# EAGLE design pi-zigbee-poe-rtc (EAGLE 9.5.0)
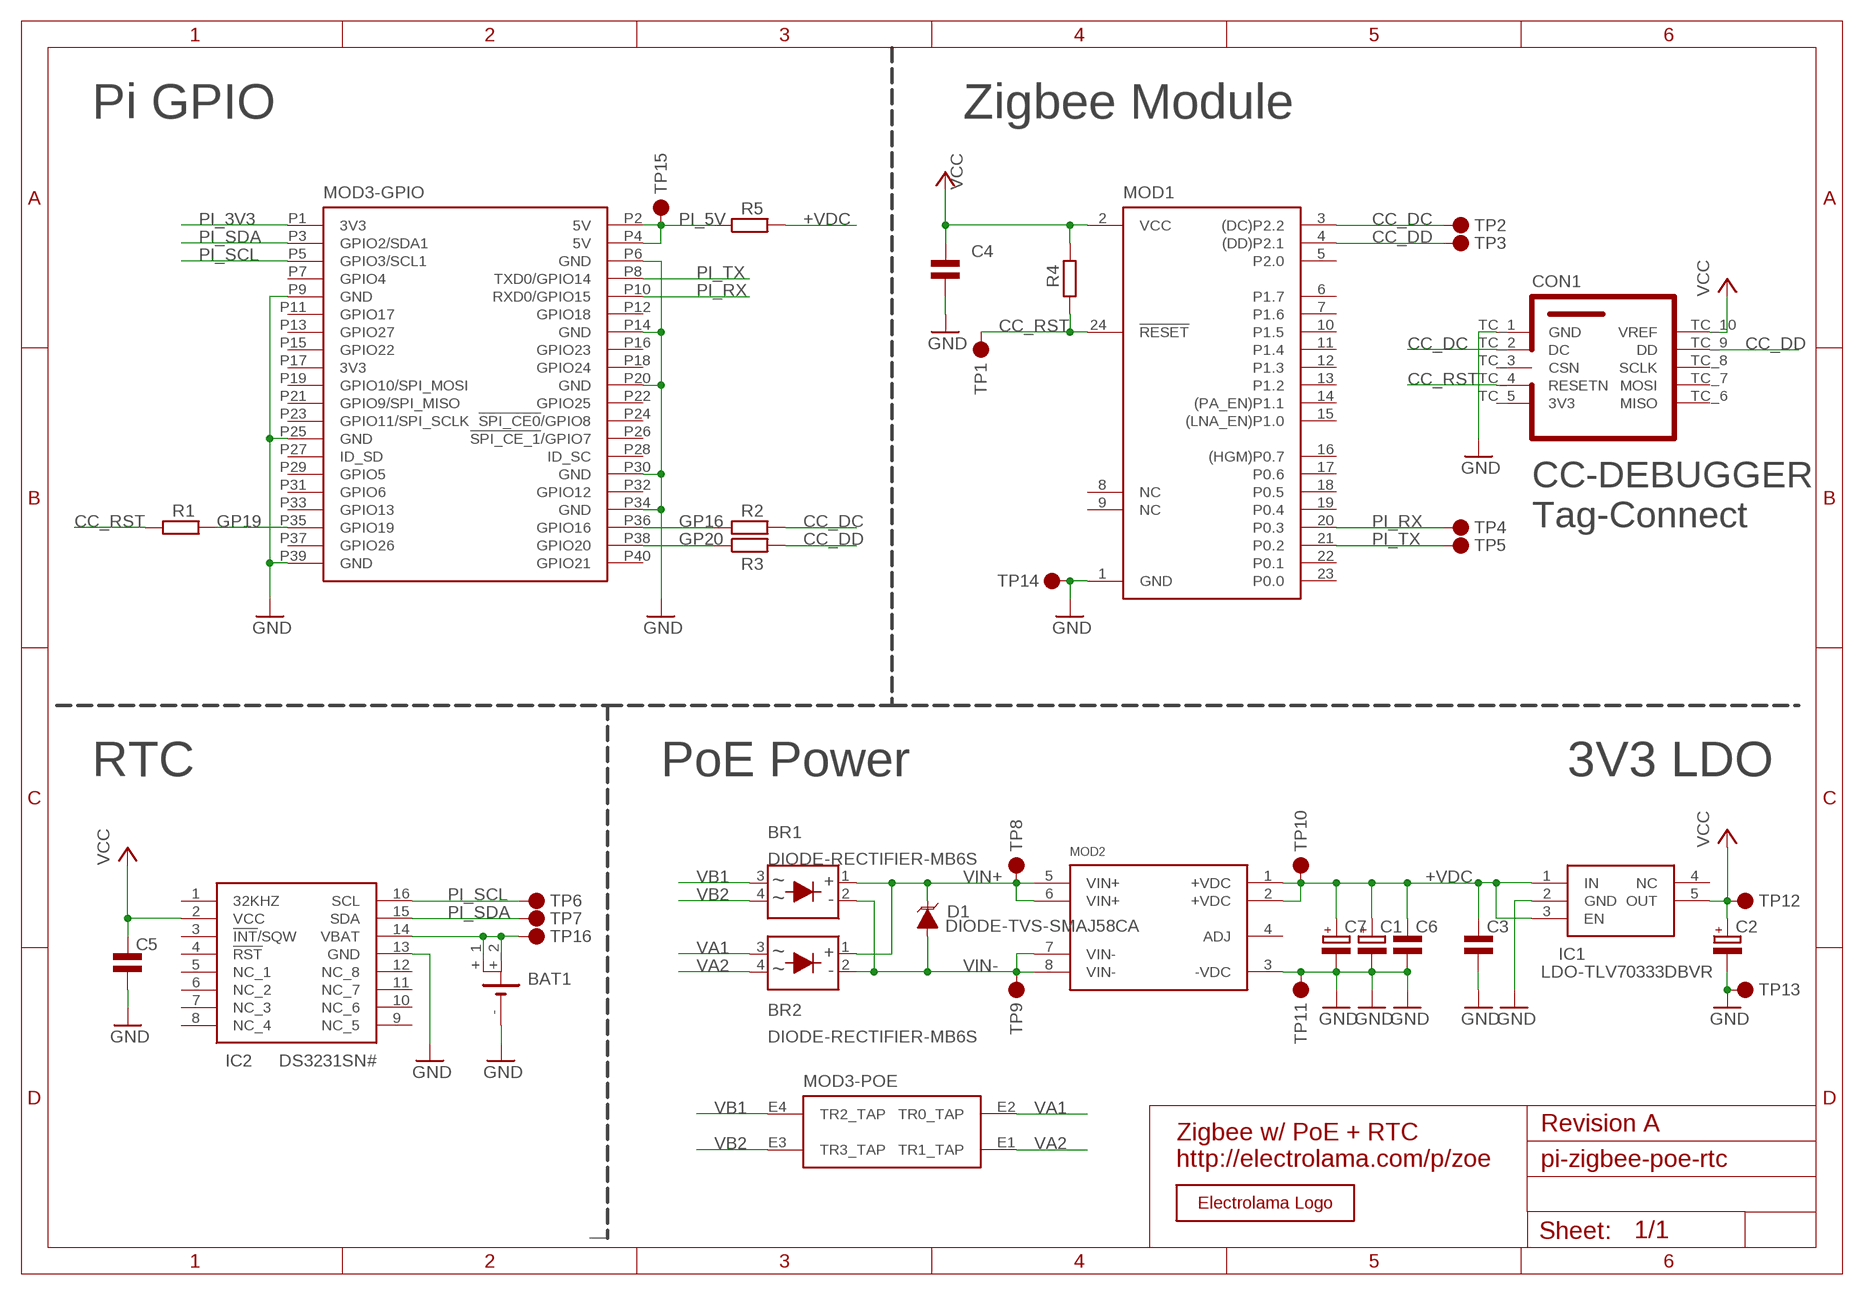
[diagram p0: schematic, sheet 1]

## Parts
BAT1  BATTERY  [KEYSTONE_3001]
BR1  DIODE-RECTIFIER-MB6S  [SOP254P665X270-4N]
BR2  DIODE-RECTIFIER-MB6S  [SOP254P665X270-4N]
C1  CAP-POL-TANT-A  [_CAP_TANT_A/3216-18R]
C2  CAP-POL-TANT-A  [_CAP_TANT_A/3216-18R]
C3  CAP-0603  [_PKG_C_0603]
C4  CAP-0603  [_PKG_C_0603]
C5  CAP-0603  [_PKG_C_0603]
C6  CAP-0603  [_PKG_C_0603]
C7  CAP-POL-ELCO-D8-L10.5  [_CAP_ELCO_D8_L10.5]
CON1  TC2050-IDC-NL_CC-DEBUGGER  [TC2050-IDC-NL]
D1  DIODE-TVS-SMAJ58CA  [DIOM5126X250N]
IC1  LDO-TLV70333DBVR  [SOT95P280X145-5N]
IC2  DS3231SN#  [SOIC127P1032X265-16N]
MOD1  EBYTE-E18-MS1PA1  [EBYTE-E18-MS1PA1]
MOD2  SILVERTEL_AG9800M  [SILVERTEL_AG9800M]
MOD3  RPI-HAT-FULL  [RPI-HAT-FULL]
R1  RES-0603  [_PKG_C_0603]
R2  RES-0603  [_PKG_C_0603]
R3  RES-0603  [_PKG_C_0603]
R4  RES-0603  [_PKG_C_0603]
R5  RES-0603  [_PKG_C_0603]
TP1  TP  [TP]
TP2  TP  [TP]
TP3  TP  [TP]
TP4  TP  [TP]
TP5  TP  [TP]
TP6  TP  [TP]
TP7  TP  [TP]
TP8  TP  [TP]
TP9  TP  [TP]
TP10  TP  [TP]
TP11  TP  [TP]
TP12  TP  [TP]
TP13  TP  [TP]
TP14  TP  [TP]
TP15  TP  [TP]
TP16  TP  [TP]
U$1  LOGO-ELECTROLAMA  [ELECTROLAMA]

## Nets
+VDC: C1.+ C3.1 C6.1 C7.+ IC1.1(IN) IC1.3(EN) MOD2.1(+VDC) MOD2.2(+VDC) R5.2 TP10.TP
CC_DC: CON1.TC_2(DC) MOD1.3((DC)P2.2) R2.2 TP2.TP
CC_DD: CON1.TC_9(DD) MOD1.4((DD)P2.1) R3.2 TP3.TP
CC_RST: CON1.TC_4(RESETN) MOD1.24(!RESET) R1.1 R4.1 TP1.TP
GND: BAT1.- C1.- C2.- C3.2 C4.2 C5.2 C6.2 C7.- CON1.TC_1(GND) IC1.2(GND) IC2.13(GND) MOD1.1(GND) MOD2.3(-VDC) MOD3.P6(-GPIO:GND) MOD3.P9(-GPIO:GND) MOD3.P14(-GPIO:GND) MOD3.P20(-GPIO:GND) MOD3.P25(-GPIO:GND) MOD3.P30(-GPIO:GND) MOD3.P34(-GPIO:GND) MOD3.P39(-GPIO:GND) TP11.TP TP13.TP TP14.TP
GP16: MOD3.P36(-GPIO:GPIO16) R2.1
GP19: MOD3.P35(-GPIO:GPIO19) R1.2
GP20: MOD3.P38(-GPIO:GPIO20) R3.1
N$1: BAT1.+_1(+1) BAT1.+_2(+2) IC2.14(VBAT) TP16.TP
PI_3V3: MOD3.P1(-GPIO:3V3)
PI_5V: MOD3.P2(-GPIO:5V) MOD3.P4(-GPIO:5V) R5.1 TP15.TP
PI_RX: MOD1.20(P0.3) MOD3.P10(-GPIO:RXD0/GPIO15) TP4.TP
PI_SCL: IC2.16(SCL) MOD3.P5(-GPIO:GPIO3/SCL1) TP6.TP
PI_SDA: IC2.15(SDA) MOD3.P3(-GPIO:GPIO2/SDA1) TP7.TP
PI_TX: MOD1.21(P0.2) MOD3.P8(-GPIO:TXD0/GPIO14) TP5.TP
VA1: BR2.3(~) MOD3.E2(-POE:TR0_TAP)
VA2: BR2.4(~) MOD3.E1(-POE:TR1_TAP)
VB1: BR1.3(~) MOD3.E4(-POE:TR2_TAP)
VB2: BR1.4(~) MOD3.E3(-POE:TR3_TAP)
VCC: C2.+ C4.1 C5.1 CON1.TC_10(VREF) IC1.5(OUT) IC2.2(VCC) MOD1.2(VCC) R4.2 TP12.TP
VIN+: BR1.1(+) BR2.1(+) D1.1(C) MOD2.5(VIN+) MOD2.6(VIN+) TP8.TP
VIN-: BR1.2(-) BR2.2(-) D1.2(A) MOD2.7(VIN-) MOD2.8(VIN-) TP9.TP
Unconnected: CON1.TC_3(CSN) CON1.TC_5(3V3) CON1.TC_6(MISO) CON1.TC_7(MOSI) CON1.TC_8(SCLK) IC1.4(NC) IC2.1(32KHZ) IC2.3(!INT!/SQW) IC2.4(!RST) IC2.5(NC_1) IC2.6(NC_2) IC2.7(NC_3) IC2.8(NC_4) IC2.9(NC_5) IC2.10(NC_6) IC2.11(NC_7) IC2.12(NC_8) MOD1.5(P2.0) MOD1.6(P1.7) MOD1.7(P1.6) MOD1.8(NC) MOD1.9(NC) MOD1.10(P1.5) MOD1.11(P1.4) MOD1.12(P1.3) MOD1.13(P1.2) MOD1.14((PA_EN)P1.1) MOD1.15((LNA_EN)P1.0) MOD1.16((HGM)P0.7) MOD1.17(P0.6) MOD1.18(P0.5) MOD1.19(P0.4) MOD1.22(P0.1) MOD1.23(P0.0) MOD2.4(ADJ) MOD3.P7(-GPIO:GPIO4) MOD3.P11(-GPIO:GPIO17) MOD3.P12(-GPIO:GPIO18) MOD3.P13(-GPIO:GPIO27) MOD3.P15(-GPIO:GPIO22) MOD3.P16(-GPIO:GPIO23) MOD3.P17(-GPIO:3V3) MOD3.P18(-GPIO:GPIO24) MOD3.P19(-GPIO:GPIO10/SPI_MOSI) MOD3.P21(-GPIO:GPIO9/SPI_MISO) MOD3.P22(-GPIO:GPIO25) MOD3.P23(-GPIO:GPIO11/SPI_SCLK) MOD3.P24(-GPIO:!SPI_CE0!/GPIO8) MOD3.P26(-GPIO:!SPI_CE_1!/GPIO7) MOD3.P27(-GPIO:ID_SD) MOD3.P28(-GPIO:ID_SC) MOD3.P29(-GPIO:GPIO5) MOD3.P31(-GPIO:GPIO6) MOD3.P32(-GPIO:GPIO12) MOD3.P33(-GPIO:GPIO13) MOD3.P37(-GPIO:GPIO26) MOD3.P40(-GPIO:GPIO21)

## Notes on the sheet
- Pi GPIO | Zigbee Module
- CC-DEBUGGER
  Tag-Connect
- RTC | PoE Power | 3V3 LDO
- Revision A
- Zigbee w/ PoE + RTC
  http://electrolama.com/p/zoe

## Library data of the parts
BAT1 = ok-connectors-dev:BATTERY
BR1 BR2 = ok-discretes-dev:DIODE-RECTIFIER: MICRO COMMERCIAL COMPONENTS - MB6S-TP - BRIDGE RECTIFIER, 500mA, 600V Source: Datasheet <https://componentsearchengine.com/Datasheets/2/MB6S-TP.pdf>; DESCRIPTION: MICRO COMMERCIAL COMPONENTS - MB6S-TP - BRIDGE RECTIFIER, 500mA, 600V; HEIGHT: 2.7mm; MANUFACTURER_NAME: Micro Commercial Components (MCC); MANUFACTURER_PART_NUMBER: MB6S-TP; MOUSER_PART_NUMBER: 833-MB6S-TP; MOUSER_PRICE-STOCK: https://www.mouser.com/Search/Refine.aspx?Keyword=833-MB6S-TP
C1 C2 C7 = ok-discretes-dev:CAP-POL
C3-C6 = ok-discretes-dev:CAP
CON1 = ok-connectors-dev:TC2050-IDC-NL_CC-DEBUGGER
D1 = ok-discretes-dev:DIODE-TVS-SMAJ58CA: DIODE, TVS, 58V, 300W, 2SMA Taiwan Semi SMAJ58CA Bi-Directional TVS Diode, 2-Pin SMA Source: Datasheet <http://uk.rs-online.com/webdocs/0dbc/0900766b80dbc8a0.pdf>; DESCRIPTION: DIODE, TVS, 58V, 300W, 2SMA Taiwan Semi SMAJ58CA Bi-Directional TVS Diode, 2-Pin SMA; HEIGHT: 2.5mm; MANUFACTURER_NAME: Taiwan Semiconductor; MANUFACTURER_PART_NUMBER: SMAJ58CA; MOUSER_PART_NUMBER: N/A; MOUSER_PRICE-STOCK: https://www.mouser.com/Search/Refine.aspx?Keyword=N%2FA
IC1 = ok-chips-dev:LDO-TLV70333DBVR: 300mA Low-IQ Low-Dropout (LDO) Regulator Source: Datasheet <http://www.ti.com/lit/gpn/tlv703>; DESCRIPTION: 300mA Low-IQ Low-Dropout (LDO) Regulator; HEIGHT: 1.45mm; MANUFACTURER_NAME: Texas Instruments; MANUFACTURER_PART_NUMBER: TLV70333DBVR; MOUSER_PART_NUMBER: 595-TLV70333DBVR; MOUSER_PRICE-STOCK: https://www.mouser.com/Search/Refine.aspx?Keyword=595-TLV70333DBVR
IC2 = ok-chips-dev:DS3231SN#: Real Time Clock Serial Maxim DS3231SN# Real Time Clock, Battery Backup, Calendar, Clock, I2C, 5.5 V, 16-Pin SOIC Source: Datasheet <https://datasheets.maximintegrated.com/en/ds/DS3231.pdf>; DESCRIPTION: Real Time Clock Serial Maxim DS3231SN# Real Time Clock, Battery Backup, Calendar, Clock, I2C, 5.5 V, 16-Pin SOIC; HEIGHT: 2.65mm; MANUFACTURER_NAME: Maxim Integrated; MANUFACTURER_PART_NUMBER: DS3231SN#; MOUSER_PART_NUMBER: 700-DS3231SN#; MOUSER_PRICE-STOCK: https://www.mouser.com/Search/Refine.aspx?Keyword=700-DS3231SN%23; RS_PART_NUMBER: 1897251; RS_PRICE-STOCK: http://uk.rs-online.com/web/p/products/1897251
MOD1 = ok-modules-dev:EBYTE-E18-MS1PA1
MOD2 = ok-modules-dev:SILVERTEL_AG9800M
MOD3 = ok-modules-dev:RPI-HAT-FULL
R1-R5 = ok-discretes-dev:RES
TP1-TP16 = ok-testdebug-dev:TP
U$1 = ok-logos-dev:LOGO-ELECTROLAMA

## Board
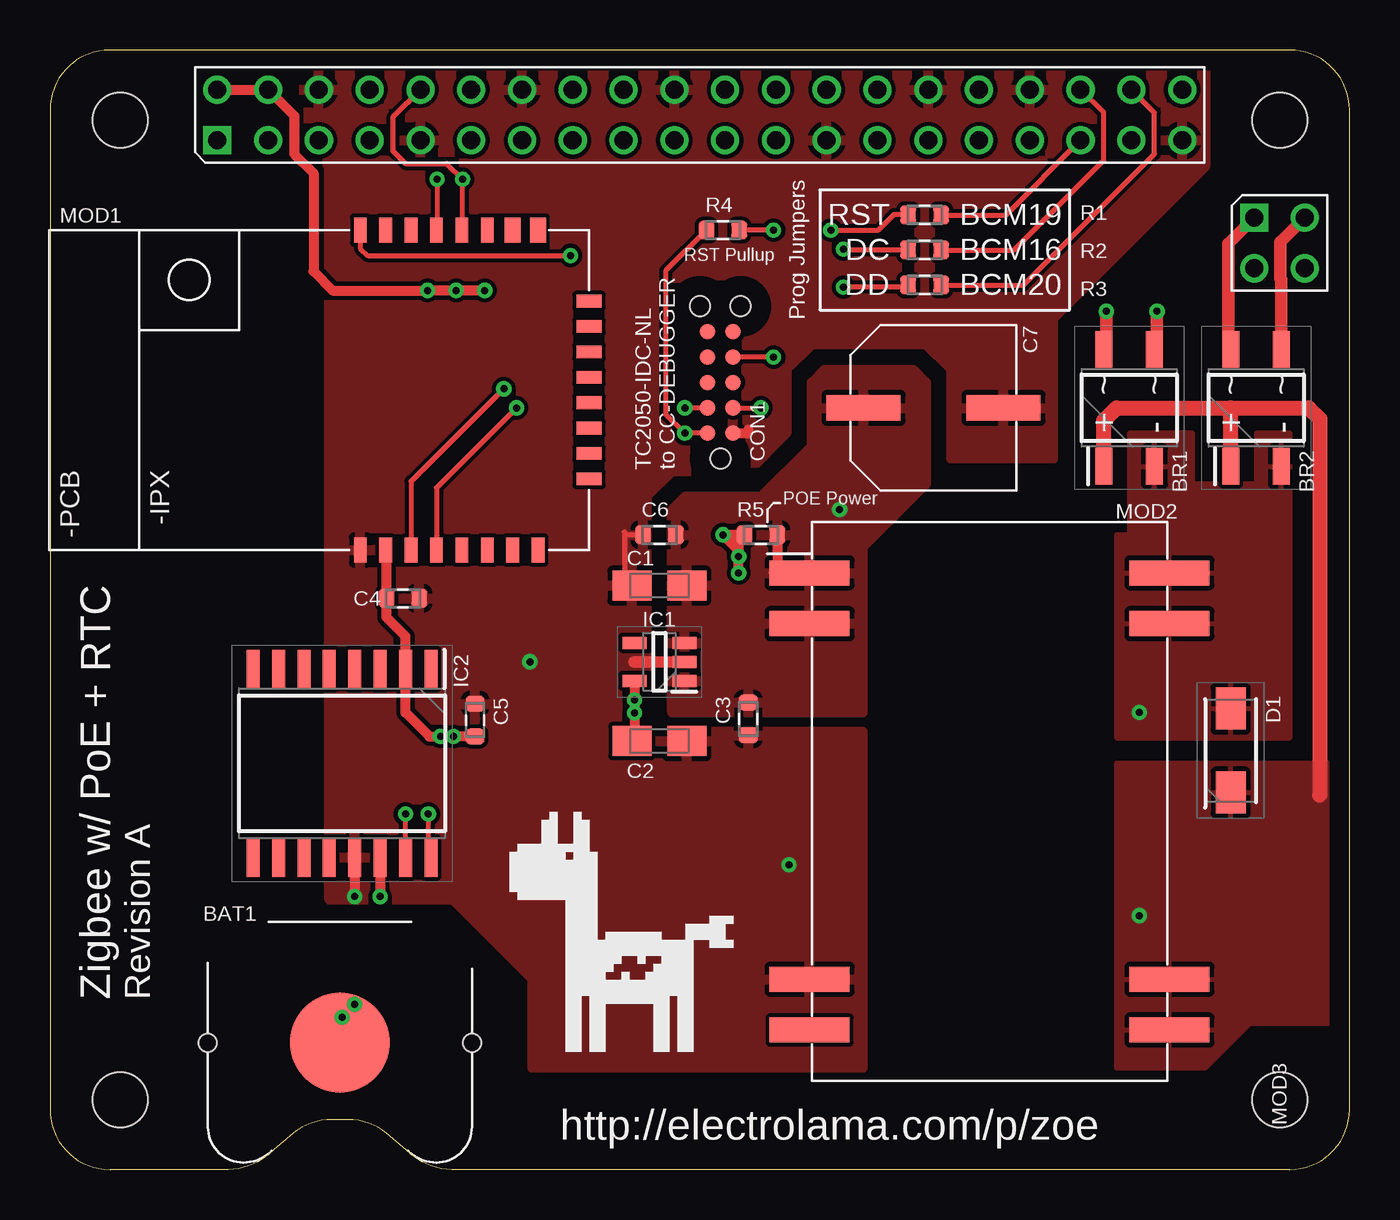
[diagram p1: board, top side]
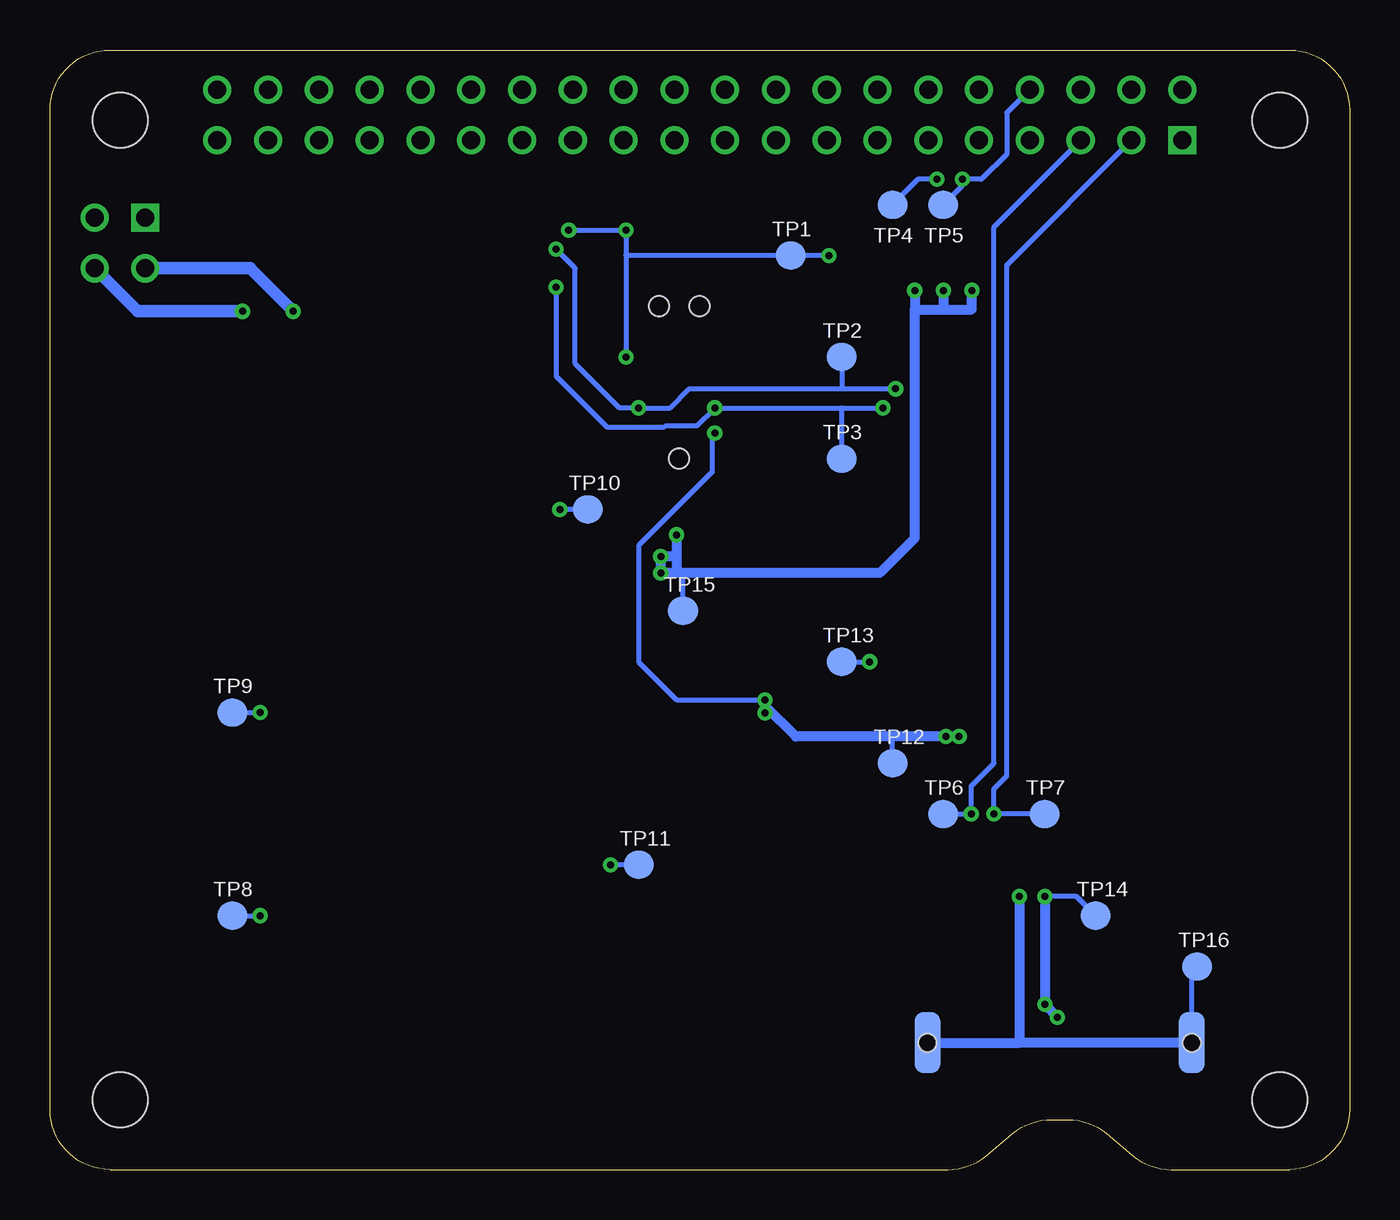
[diagram p2: board, bottom side, seen from below]

Size 65 x 56 mm. Coordinates in mm from the lower left corner, seen from the top.
Outline: 62,56 3,56 arc90 0,53 0,3 arc90 3,0 8.91,0 arc40 10.83,0.69 12.17,1.8 arc-40 14.09,2.5 14.91,2.5 arc-40 16.83,1.8 18.17,0.69 arc40 20.09,0 62,0 arc90 65,3 65,53 arc90 62,56
Copper layers (1*16): Top 0.035mm / dielectric 0.15mm / Bottom 0.035mm
Design rules "default *": minimum track width 6mil, minimum drill 0.35mm, track to track 8mil, track to pad 8mil, pad to pad 8mil, via to via 8mil, smd to smd 8mil, copper to edge 40mil, drill to drill 6mil, minimum pad ring 10mil, minimum via ring 8mil, stop-mask expansion 4mil, vias tented up to drill 50mil, thermal gap 10mil

### Footprints (pad centres in the part's own frame; a part is rotated, then mirrored left to right if it is on the bottom)
KEYSTONE_3001 = smd 1.27 x 3.048 bottom: +_1 -6.604,0; +_2 6.604,0 | smd 5 x 5: - 0,0 | hole 0.9: -6.604,0; 6.604,0
SOP254P665X270-4N = smd 1.8 x 0.85: 1 -2.925,1.27; 2 -2.925,-1.27; 3 2.925,-1.27; 4 2.925,1.27
_CAP_TANT_A/3216-18R = smd 1.95 x 1.5: + 1.375,0; - -1.375,0
_PKG_C_0603 = smd 0.79 x 0.93: 1 -0.82,0; 2 0.82,0
_CAP_ELCO_D8_L10.5 = smd 3.7 x 1.3: + 3.5,0; - -3.5,0
TC2050-IDC-NL = smd 0.787 x 0.787: TC_1 1.27,-0.635; TC_2 2.54,-0.635; TC_3 3.81,-0.635; TC_4 5.08,-0.635; TC_5 6.35,-0.635; TC_6 6.35,0.635; TC_7 5.08,0.635; TC_8 3.81,0.635; TC_9 2.54,0.635; TC_10 1.27,0.635 | hole 1: 0,0; 7.62,-1.016; 7.62,1.016
DIOM5126X250N = smd 2.1 x 1.5: 1 -2.1,0; 2 2.1,0
SOT95P280X145-5N = smd 1.2 x 0.6: 1 -1.25,0.95; 2 -1.25,0; 3 -1.25,-0.95; 4 1.25,-0.95; 5 1.25,0.95
SOIC127P1032X265-16N = smd 1.925 x 0.65: 1 -4.712,4.445; 2 -4.712,3.175; 3 -4.712,1.905; 4 -4.712,0.635; 5 -4.712,-0.635; 6 -4.712,-1.905; 7 -4.712,-3.175; 8 -4.712,-4.445; 9 4.712,-4.445; 10 4.712,-3.175; 11 4.712,-1.905; 12 4.712,-0.635; 13 4.712,0.635; 14 4.712,1.905; 15 4.712,3.175; 16 4.712,4.445
EBYTE-E18-MS1PA1 = smd 1.27 x 0.635: 1 8,2.06; 2 8,3.33; 3 8,4.6; 4 8,5.87; 5 8,7.14; 6 8,8.41; 7 8,9.68; 8 8,10.95; 19 -8,8.41; 20 -8,7.14; 21 -8,5.87; 22 -8,4.6; 23 -8,3.33; 24 -8,2.06 | smd 0.635 x 1.27: 9 4.44,13.5; 10 3.17,13.5; 11 1.9,13.5; 12 0.63,13.5; 13 -0.64,13.5; 14 -1.91,13.5; 15 -3.18,13.5; 16 -4.45,13.5 | smd 1.27 x 0.8: 17 -8,10.95; 18 -8,9.68
SILVERTEL_AG9800M = smd 1.25 x 4: 1 -11.43,-9; 2 -8.89,-9; 3 8.89,-9; 4 11.43,-9; 5 11.43,9; 6 8.89,9; 7 -8.89,9; 8 -11.43,9
RPI-HAT-FULL = drill 0.9 square: E1 60.23,47.619; P1 8.369,51.479 | drill 0.9: E2 62.77,47.619; E3 60.23,45.079; E4 62.77,45.079; P2 8.369,54.019; P3 10.909,51.479; P4 10.909,54.019; P5 13.449,51.479; P6 13.449,54.019; P7 15.989,51.479; P8 15.989,54.019; P9 18.529,51.479; P10 18.529,54.019; P11 21.069,51.479; P12 21.069,54.019; P13 23.609,51.479; P14 23.609,54.019; P15 26.149,51.479; P16 26.149,54.019; P17 28.689,51.479; P18 28.689,54.019; P19 31.229,51.479; P20 31.229,54.019; P21 33.769,51.479; P22 33.769,54.019; P23 36.309,51.479; P24 36.309,54.019; P25 38.849,51.479; P26 38.849,54.019; P27 41.389,51.479; P28 41.389,54.019; P29 43.929,51.479; P30 43.929,54.019; P31 46.469,51.479; P32 46.469,54.019; P33 49.009,51.479; P34 49.009,54.019; P35 51.549,51.479; P36 51.549,54.019; P37 54.089,51.479; P38 54.089,54.019; P39 56.629,51.479; P40 56.629,54.019 | hole 2.75: 3.5,52.5; 61.5,52.5; 61.5,3.5; 3.5,3.5
TP = smd 1.5 x 1.4: TP 0,0

### Placement (x,y rotation side)
BAT1  14.5,6.35 180 top
BR1  53.98,38.1 90 top
BR2  60.33,38.1 90 top
C1  30.48,29.21 0 top
C2  30.48,21.43 180 top
C3  34.92,22.54 270 top
C4  17.65,28.57 0 top
C5  21.27,22.48 90 top
C6  30.48,31.75 180 top
C7  44.2,38.1 180 top
CON1  33.53,35.56 90 top
D1  59.05,20.95 90 top
IC1  30.48,25.4 180 top
IC2  14.61,20.32 270 top
MOD1  13.46,38.99 270 top
MOD2  46.99,18.41 270 top
MOD3  0,0 0 top
R1  43.75,47.75 0 top
R2  43.75,46 180 top
R3  43.75,44.25 180 top
R4  33.66,46.99 180 top
R5  35.56,31.75 0 top
TP1  27.94,45.72 0 bottom
TP2  25.4,40.64 0 bottom
TP3  25.4,35.56 0 bottom
TP4  22.86,48.26 0 bottom
TP5  20.32,48.26 0 bottom
TP6  20.32,17.78 0 bottom
TP7  15.24,17.78 0 bottom
TP8  55.88,12.7 0 bottom
TP9  55.88,22.86 0 bottom
TP10  38.1,33.02 0 bottom
TP11  35.56,15.24 0 bottom
TP12  22.86,20.32 0 bottom
TP13  25.4,25.4 0 bottom
TP14  12.7,12.7 0 bottom
TP15  33.34,27.94 0 bottom
TP16  7.62,10.16 0 bottom
U$1  29,10.45 0 top

### Tracks (layer width: path | path; a pad name or v marks a point on that pad's centre or on a via)
+VDC  (via drill 0.35)
  Top 0.508: R5.2 36.38,30.03 36.2,29.84 36.51,29.53 37.67,29.53 MOD2.1
  Bottom 0.254: TP10.TP v39.5,33.02
  pour Top: 31.11,22.86 31.11,33.02 31.75,33.66 35.56,33.66 38.1,36.2 38.1,38.1 38.1,38.73 38.1,39.37 38.73,40.01 42.55,40.01 43.18,40.01 43.81,39.37 43.81,34.29 40.64,31.11 40.64,26.04 40.64,22.86
CC_DC  (via drill 0.35)
  Top 0.254: CON1.TC_2 v35.56,38.1 | v22.7,39.05 18.06,34.41 MOD1.3 | R2.2 39.73,46 v39.69,46.04
  Bottom 0.254: 25.4,39.05 33.02,39.05 33.97,38.1 v35.56,38.1 36.51,38.1 38.73,40.32 38.73,45.09 v39.69,46.04 | 25.4,39.05 v22.7,39.05 | TP2.TP 25.4,39.05
CC_DD  (via drill 0.35)
  Top 0.254: CON1.TC_9 v31.75,38.1 | v23.34,38.1 19.33,34.1 MOD1.4 | R3.2 42.81,44.13 v39.69,44.13
  Bottom 0.254: 25.4,38.1 v31.75,38.1 32.65,37.2 34.21,37.2 34.26,37.15 37.15,37.15 39.69,39.69 v39.69,44.13 | 25.4,38.1 v23.34,38.1 | TP3.TP 25.4,38.1
CC_RST  (via drill 0.35)
  Top 0.254: v36.2,40.64 CON1.TC_4 | MOD1.24 15.52,46.07 15.88,45.72 v26.04,45.72 | v39.05,46.99 41.43,46.99 42.23,47.78 42.9,47.78 R1.1 | v36.2,46.99 R4.1
  Bottom 0.254: v39.05,46.99 v36.2,46.99 36.2,45.72 36.19,45.72 | 36.19,45.72 36.19,40.65 v36.2,40.64 | v26.04,45.72 TP1.TP 36.19,45.72
GND  (via drill 0.35)
  Top 0.254: C6.2 28.89,31.75 28.73,31.91 28.73,29.58 C1.-
  Top 0.508: CON1.TC_1 34.92,36.83 34.92,36.99 | IC2.13 v15.24,13.65 | v14.61,7.62 14.61,6.46 BAT1.- 14.5,7.51 v14.61,7.62 | v14.61,7.62 v15.24,8.26
  Top 0.584: IC1.2 29.21,25.4
  Bottom 0.254: TP14.TP 13.65,13.65 v15.24,13.65 | TP13.TP v24,25.4 | TP11.TP v36.96,15.24
  Bottom 0.508: v15.24,13.65 v15.24,8.26 v14.61,7.62
  pour Top: 50.16,35.56 45.09,35.56 45.09,40.01 43.81,41.27 38.1,41.27 36.83,40.01 36.83,36.83 34.92,34.92 31.11,34.92 29.84,33.66 29.84,22.86 30.8,21.91 40.64,21.91 40.64,5.08 24.13,5.08 24.13,9.53 20.16,13.49 13.97,13.49 13.97,50.16 12.7,51.44 12.7,55.56 57.78,55.56 57.78,50.16 50.16,42.55
GP16
  Top 0.254: R2.1 48.22,46 52.7,50.48 52.7,52.86 MOD3.P36
GP19
  Top 0.254: R1.2 47.82,47.75 MOD3.P35
GP20
  Top 0.254: R3.1 48.7,44.25 55.24,50.8 55.24,52.86 MOD3.P38
N$1  (via drill 0.35)
  Top 0.508: IC2.14 v16.51,13.65
  Bottom 0.254: BAT1.+_2 7.9,9.88 TP16.TP
  Bottom 0.508: BAT1.+_1 16.51,6.35 | v16.51,13.65 16.51,6.35 | BAT1.+_2 16.51,6.35
PI_5V  (via drill 0.35)
  Top 0.508: MOD3.P2 MOD3.P4 12.22,52.7 12.22,50.8 13.18,49.85 13.18,44.93 14.13,43.97 v18.89,43.97 v20.32,43.97 v21.75,43.97 | v34.45,30.67 34.45,31.43 34.74,31.72 R5.1 v33.66,31.75 34.45,30.96 v34.45,30.67 | v34.45,29.84 v34.45,30.67
  Bottom 0.254: TP15.TP 33.34,29.84
  Bottom 0.508: 21.75,43.02 21.75,31.59 23.5,29.84 33.34,29.84 33.66,29.84 | 33.66,29.84 v34.45,29.84 v34.45,30.67 33.69,30.67 33.66,30.64 | v33.66,31.75 33.66,30.64 | 33.66,30.64 33.66,29.84 | 21.75,43.02 20.32,43.02 | 20.32,43.02 18.89,43.02 v18.89,43.97 | v20.32,43.97 20.32,43.02 | v21.75,43.97 21.75,43.02
PI_RX  (via drill 0.35)
  Top 0.254: MOD3.P10 17.14,52.63 17.14,50.96 17.78,50.32 19.84,50.32 v20.64,49.53 20.64,47.02 MOD1.20
  Bottom 0.254: v20.64,49.53 21.59,49.53 TP4.TP
PI_SCL  (via drill 0.35)
  Top 0.254: v18.92,17.78 18.92,15.73 IC2.16
  Bottom 0.254: MOD3.P5 17.78,47.15 17.78,20.32 18.92,19.18 v18.92,17.78 TP6.TP
PI_SDA  (via drill 0.35)
  Top 0.254: IC2.15 v17.78,17.78
  Bottom 0.254: MOD3.P3 17.14,45.24 17.14,19.68 17.78,19.05 v17.78,17.78 TP7.TP
PI_TX  (via drill 0.35)
  Top 0.254: v19.37,49.53 19.37,47.02 MOD1.21
  Bottom 0.254: MOD3.P8 17.14,52.86 17.14,50.8 18.41,49.53 v19.37,49.53 19.37,49.21 TP5.TP
VA1
  Top 0.635: BR2.3 61.59,44.52 61.55,44.57 61.55,46.39 MOD3.E2
VA2
  Top 0.635: MOD3.E1 58.93,46.32 58.93,41.15 BR2.4
VB1  (via drill 0.35)
  Top 0.635: v55.37,42.93 55.37,41.15 BR1.3
  Bottom 0.635: MOD3.E4 60.62,42.93 v55.37,42.93
VB2  (via drill 0.35)
  Top 0.635: v52.83,42.93 52.83,41.15 BR1.4
  Bottom 0.635: MOD3.E3 54.98,45.08 v52.83,42.93
VCC  (via drill 0.35)
  Top 0.254: CON1.TC_10 v31.75,36.83 30.8,37.78 30.8,44.95 R4.2
  Top 0.508: C2.+ 29.23,21.56 v29.23,22.83 v29.23,23.5 IC1.5 | C5.1 v20.19,21.66 v19.53,21.66 18.98,21.66 17.78,22.86 IC2.2 17.78,26.67 16.83,27.62 C4.1 | MOD1.2 16.83,30.95 C4.1 | C4.1
  Bottom 0.254: v31.75,36.83 31.89,36.7 31.89,34.88 35.56,31.2 35.56,25.4 33.66,23.5 v29.23,23.5 | TP12.TP 22.86,21.66
  Bottom 0.508: v19.53,21.66 22.86,21.66 27.69,21.66 29.23,23.2 v29.23,23.5
VIN+  (via drill 0.35)
  Top 0.762: BR1.1 52.7,37.47 53.34,38.1 59.05,38.1 | BR2.1 59.05,38.1 | 59.05,38.1 62.97,38.1 63.51,37.55 63.51,18.75 63.5,18.73
  Bottom 0.254: TP8.TP v54.48,12.7
  pour Top: 53.34,20.32 53.34,5.08 57.78,5.08 60.01,7.3 64.14,7.3 64.14,20.32
VIN-  (via drill 0.35)
  Bottom 0.254: TP9.TP v54.48,22.86
  pour Top: 53.34,21.59 62.03,21.59 62.03,36.83 60.33,36.83 60.33,34.29 57.15,34.29 57.15,36.83 53.98,36.83 53.98,31.75 53.34,31.75

### Text on the board
tPlace: RST | BCM19 | R1 | DC | BCM16 | R2 | RST Pullup | DD | BCM20 | R3 | Prog Jumpers | TC2050-IDC-NL / to CC-DEBUGGER | POE Power | Zigbee w/ PoE + RTC | Revision A | http://electrolama.com/p/zoe